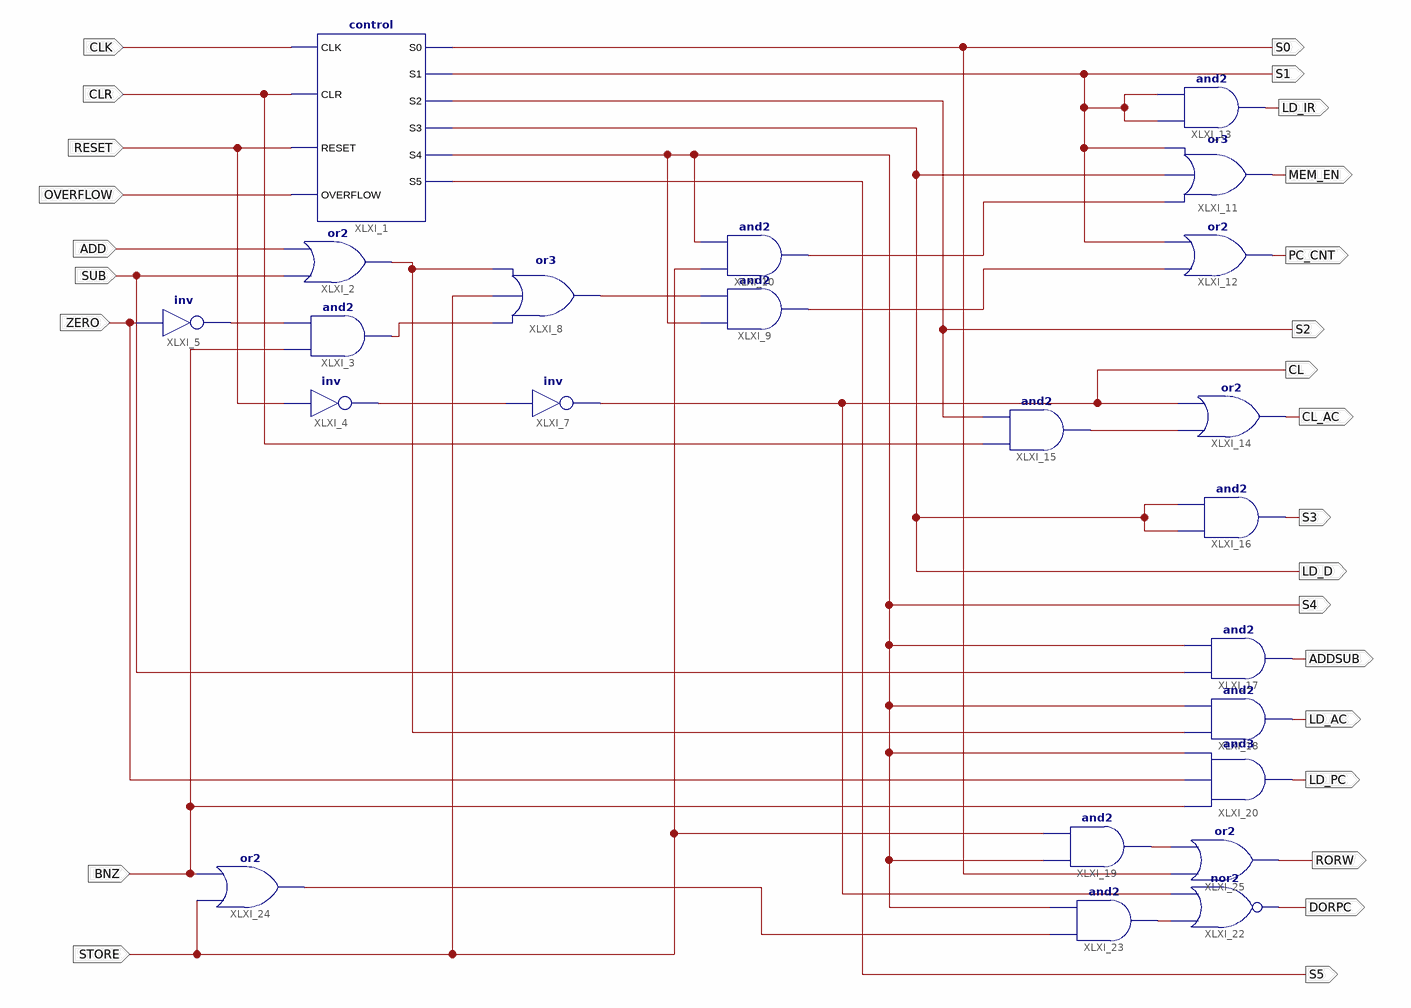
[diagram p0: schematic sheet 1]
// Xilinx ISE schematic controller_sch.sch (spartan3e) as structural Verilog: 23 symbols, 26 ports
module controller_sch (
  input  CLK,
  input  ADD,
  input  ZERO,
  input  CLR,
  input  RESET,
  input  SUB,
  input  BNZ,
  input  STORE,
  input  OVERFLOW,
  output S4,
  output S0,
  output S1,
  output MEM_EN,
  output PC_CNT,
  output S2,
  output LD_IR,
  output CL_AC,
  output CL,
  output S3,
  output LD_D,
  output ADDSUB,
  output LD_AC,
  output LD_PC,
  output DORPC,
  output S5,
  output RORW
);

  wire XLXN_9, XLXN_11, XLXN_12, XLXN_14, XLXN_21, XLXN_22, XLXN_33, XLXN_50, XLXN_54, XLXN_66, XLXN_185;

  control XLXI_1 (
    .CLK(CLK), .CLR(CLR), .RESET(RESET), .OVERFLOW(OVERFLOW), .S0(S0), .S1(S1), .S2(S2), .S3(LD_D), .S4(S4),
    .S5(S5));
  and XLXI_3 (XLXN_12, BNZ, XLXN_9);
  or XLXI_2 (XLXN_50, SUB, ADD);
  not XLXI_5 (XLXN_9, ZERO);
  or XLXI_8 (XLXN_14, XLXN_12, STORE, XLXN_50);
  and XLXI_9 (XLXN_21, S4, XLXN_14);
  and XLXI_10 (XLXN_22, STORE, S4);
  or XLXI_11 (MEM_EN, XLXN_22, LD_D, S1);
  or XLXI_12 (PC_CNT, XLXN_21, S1);
  and XLXI_13 (LD_IR, S1, S1);
  or XLXI_14 (CL_AC, XLXN_33, CL);
  and XLXI_15 (XLXN_33, CLR, S2);
  not XLXI_4 (XLXN_11, RESET);
  not XLXI_7 (CL, XLXN_11);
  and XLXI_16 (S3, LD_D, LD_D);
  and XLXI_17 (ADDSUB, SUB, S4);
  and XLXI_18 (LD_AC, XLXN_50, S4);
  and XLXI_19 (XLXN_185, S4, STORE);
  and XLXI_20 (LD_PC, BNZ, ZERO, S4);
  nor XLXI_22 (DORPC, XLXN_54, CL);
  and XLXI_23 (XLXN_54, XLXN_66, S4);
  or XLXI_24 (XLXN_66, STORE, BNZ);
  or XLXI_25 (RORW, S0, XLXN_185);
endmodule
